# Altium schematic sheet GEN.SchDoc
size A4; SheetNumber: 1; SheetTotal: 5
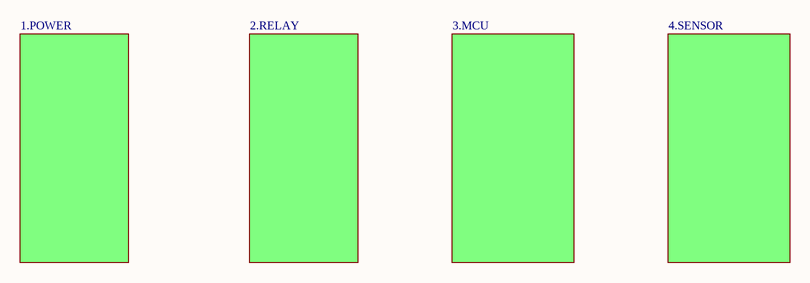
[diagram p0: GEN.SchDoc]

## Sub-sheets
Designator = 1.POWER: no entries
Designator = 2.RELAY: no entries
Designator = 3.MCU: no entries
Designator = 4.SENSOR: no entries